# EAGLE design BLE (EAGLE 9.5.2)
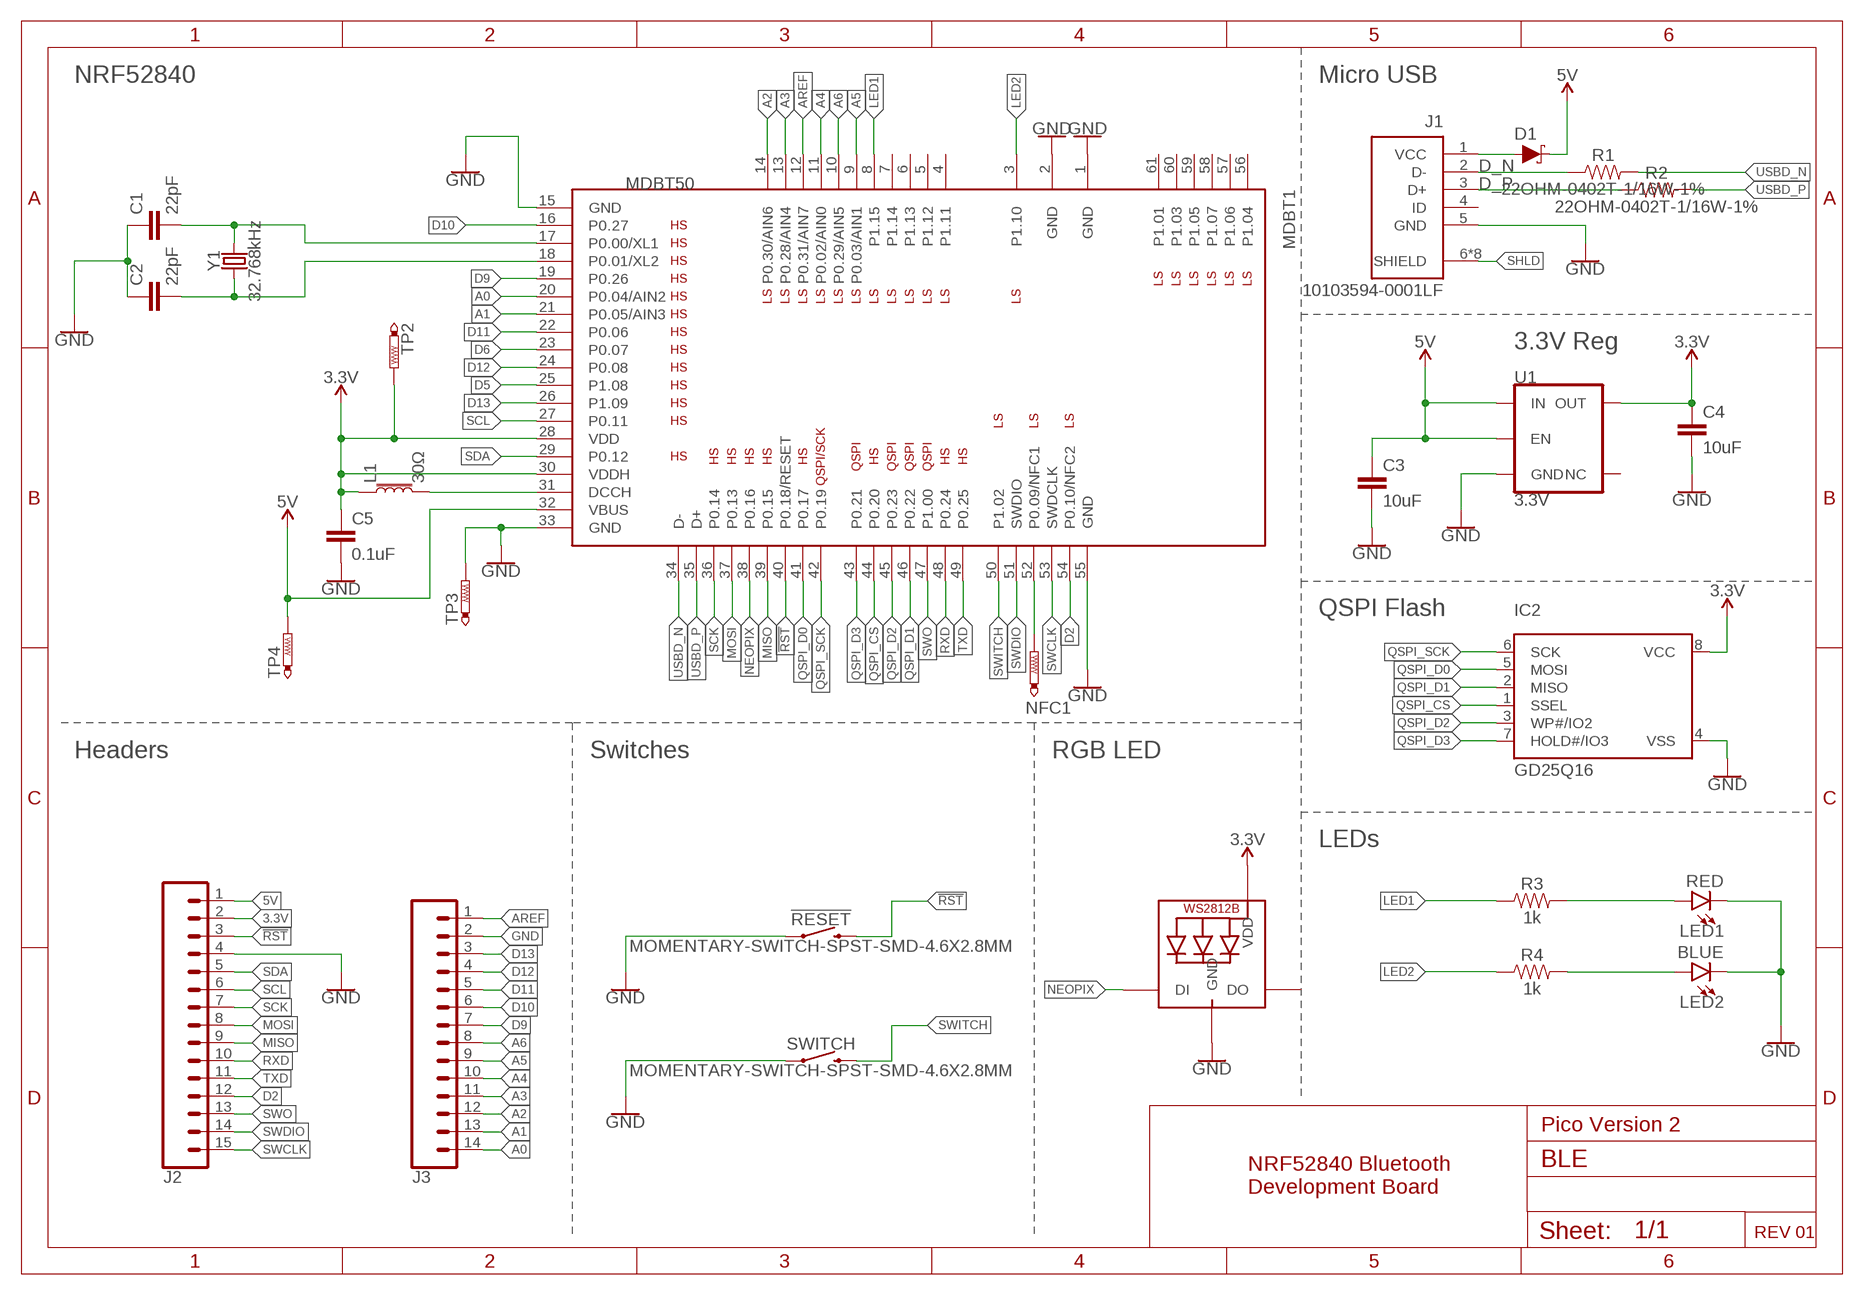
[diagram p0: schematic, sheet 1]

## Parts
!RESET!  MOMENTARY-SWITCH-SPST-SMD-4.6X2.8MM  [TACTILE_SWITCH_SMD_4.6X2.8MM]
C1  22pF  22PF-0402T-16V-10%  [0402-TIGHT]
C2  22pF  22PF-0402T-16V-10%  [0402-TIGHT]
C3  10uF  10UF-0603-6.3V-20%  [0603]
C4  10uF  10UF-0603-6.3V-20%  [0603]
C5  0.1uF  0.1UF-0402T-10V-10%-X7R  [0402-TIGHT]
D1  0.5A/40V/420mV  DIODE-SCHOTTKY-PMEG4005EJ  [SOD-323]
IC2  GD25Q16  SPIFLASH_8PINUX  [USON8]
J1  10103594-0001LF  [AMPHENOL_10103594-0001LF]
J2  CONN_15  [1X15]
J3  CONN_14  [1X14]
L1  30Ω  FERRITE_BEAD-0402-30OHM-100MHZ  [0402-TIGHT]
LED1  RED  LED-RED0603  [LED-0603]
LED2  BLUE  LED-BLUE0603  [LED-0603]
MDBT1  MDBT50  [MDBT50]
NFC1  PTR1TP10R  [TP10R]
R1  22OHM-0402T-1/16W-1%  [0402-TIGHT]
R2  22OHM-0402T-1/16W-1%  [0402-TIGHT]
R3  1k  1KOHM-0402T-1/16W-1%  [0402-TIGHT]
R4  1k  1KOHM-0402T-1/16W-1%  [0402-TIGHT]
RGB_LED  WS2812B_SK6805_1515  [SK6805_1515]
SWITCH  MOMENTARY-SWITCH-SPST-SMD-4.6X2.8MM  [TACTILE_SWITCH_SMD_4.6X2.8MM]
TP2  PTR1TP07R  [TP07R]
TP3  PTR1TP07R  [TP07R]
TP4  PTR1TP07R  [TP07R]
U1  3.3V  V_REG_AP2112K-3.3V  [SOT23-5]
Y1  32.768kHz  CRYSTAL-32.768KHZSMD-3.2X1.5  [CRYSTAL-SMD-3.2X1.5MM]

## Nets
3.3V: C4.1 C5.1 IC2.8(VCC) J2.2 L1.1 MDBT1.28(VDD) MDBT1.30(VDDH) RGB_LED.2(VDD) TP2.TP U1.5(OUT)
5V: C3.1 D1.C J2.1 MDBT1.32(VBUS) TP4.TP U1.1(IN) U1.3(EN)
!RST!: !RESET!.3 !RESET!.4 J2.3 MDBT1.40(P0.18/RESET)
A0: J3.14 MDBT1.20(P0.04/AIN2)
A1: J3.13 MDBT1.21(P0.05/AIN3)
A2: J3.12 MDBT1.14(P0.30/AIN6)
A3: J3.11 MDBT1.13(P0.28/AIN4)
A4: J3.10 MDBT1.11(P0.02/AIN0)
A5: J3.9 MDBT1.9(P0.03/AIN1)
A6: J3.8 MDBT1.10(P0.29/AIN5)
AREF: J3.1 MDBT1.12(P0.31/AIN7)
D2: J2.12 MDBT1.54(P0.10/NFC2)
D5: MDBT1.25(P1.08)
D6: MDBT1.23(P0.07)
D9: J3.7 MDBT1.19(P0.26)
D10: J3.6 MDBT1.16(P0.27)
D11: J3.5 MDBT1.22(P0.06)
D12: J3.4 MDBT1.24(P0.08)
D13: J3.3 MDBT1.26(P1.09)
D_N: J1.2(D-) R1.1
D_P: J1.3(D+) R2.1
GND: !RESET!.1 !RESET!.2 C1.1 C2.1 C3.2 C4.2 C5.2 IC2.4(VSS) J1.5(GND) J2.4 J3.2 LED1.C LED2.C MDBT1.1(GND) MDBT1.2(GND) MDBT1.15(GND) MDBT1.33(GND) MDBT1.55(GND) RGB_LED.4(GND) SWITCH.1 SWITCH.2 TP3.TP U1.2(GND)
LED1: MDBT1.8(P1.15) R3.1
LED2: MDBT1.3(P1.10) R4.1
MISO: J2.9 MDBT1.39(P0.15)
MOSI: J2.8 MDBT1.37(P0.13)
N$1: C1.2 MDBT1.17(P0.00/XL1) Y1.P$2
N$2: C2.2 MDBT1.18(P0.01/XL2) Y1.P$1
N$3: D1.A J1.1(VCC)
N$4: MDBT1.52(P0.09/NFC1) NFC1.TP
N$5: L1.2 MDBT1.31(DCCH)
N$8: LED1.A R3.2
N$9: LED2.A R4.2
NEOPIX: MDBT1.38(P0.16) RGB_LED.1(DI)
QSPI_CS: IC2.1(SSEL) MDBT1.44(P0.20)
QSPI_D0: IC2.5(MOSI) MDBT1.41(P0.17)
QSPI_D1: IC2.2(MISO) MDBT1.46(P0.22)
QSPI_D2: IC2.3(WP#/IO2) MDBT1.45(P0.23)
QSPI_D3: IC2.7(HOLD#/IO3) MDBT1.43(P0.21)
QSPI_SCK: IC2.6(SCK) MDBT1.42(P0.19)
RXD: J2.10 MDBT1.48(P0.24)
SCK: J2.7 MDBT1.36(P0.14)
SCL: J2.6 MDBT1.27(P0.11)
SDA: J2.5 MDBT1.29(P0.12)
SHLD: J1.6(SHIELD) J1.7(SHIELD) J1.8(SHIELD) J1.9(SHIELD) J1.10(SHIELD) J1.11(SHIELD) J1.S1(SHIELD) J1.S2(SHIELD)
SWCLK: J2.15 MDBT1.53(SWDCLK)
SWDIO: J2.14 MDBT1.51(SWDIO)
SWITCH: MDBT1.50(P1.02) SWITCH.3 SWITCH.4
SWO: J2.13 MDBT1.47(P1.00)
TXD: J2.11 MDBT1.49(P0.25)
USBD_N: MDBT1.34(D-) R1.2
USBD_P: MDBT1.35(D+) R2.2
Unconnected: J1.4(ID) MDBT1.4(P1.11) MDBT1.5(P1.12) MDBT1.6(P1.13) MDBT1.7(P1.14) MDBT1.56(P1.04) MDBT1.57(P1.06) MDBT1.58(P1.07) MDBT1.59(P1.05) MDBT1.60(P1.03) MDBT1.61(P1.01) RGB_LED.3(DO) U1.4(NC)

## Notes on the sheet
- NRF52840 | Micro USB
- 3.3V Reg
- QSPI Flash
- Headers | Switches | RGB LED
- LEDs
- Pico Version 2
- NRF52840 Bluetooth
  Development Board
- REV 01

## Library data of the parts
!RESET! SWITCH = SparkFun-Switches:MOMENTARY-SWITCH-SPST: Momentary Switch (Pushbutton) - SPST Normally-open (NO) SPST momentary switches (buttons, pushbuttons). Variants PTH-12MM - 12mm square, through-hole Momentary Pushbutton Switch - 12mm Square <https://www.sparkfun.com/products/9190> (COM-09190) PTH-6.0MM, PTH-6.0MM-KIT - 6.0mm square, through-hole Mini Pushbutton Switch <https://www.sparkfun.com/products/97> (COM-00097) KIT package intended for soldering kit's - only one side of pads' copper is exposed. PTH-RIGHT-ANGLE-KIT - Right-angle, through-hole Right Angle Tactile Button <https://www.sparkfun.com/products/10791> - Used on SparkFun BigTime Watch Kit <https://www.sparkfun.com/products/11734> SMD-12MM - 12mm square, surface-mount Tactile Button - SMD (12mm) <https://www.sparkfun.com/products/12993> (COM-12993) Used on SparkFun PicoBoard <https://www.sparkfun.com/products/11888> SMD-4.5MM - 4.5mm Square Trackball Switch Used on SparkFun Blackberry Trackballer Breakout <https://www.sparkfun.com/products/13169> SMD-4.6MMX2.8MM - 4.60mm x 2.80mm, surface mount Used on SparkFun SAMD21 Mini Breakout <https://www.sparkfun.com/products/13664> SMD-5.2MM, SMD-5.2-REDUNDANT - 5.2mm square, surface-mount Mini Pushbutton Switch - SMD <https://www.sparkfun.com/products/8720> (COM-08720) Used on Arduino Pro Mini <https://www.sparkfun.com/products/11114> REDUNDANT package connects both switch circuits together SMD-6.0X3.5MM - 6.0 x 3.5mm, surface mount Momentary Reset Switch SMD <https://www.sparkfun.com/products/8229> (COM-08229) SMD-6.2MM-TALL - 6.2mm square, surface mount Tactile Button - SMD (6mm) <https://www.sparkfun.com/products/12992> Used on SparkFun Digital Sandbox <https://www.sparkfun.com/products/12651> SMD-RIGHT-ANGLE - Right-angle, surface mount Used on SparkFun Block for Intel® Edison - Arduino <https://www.sparkfun.com/products/13036>; PROD_ID: SWCH-13065
C1 C2 = SparkFun-Capacitors:22PF: 22pF ceramic capacitors A capacitor is a passive two-terminal electrical component used to store electrical energy temporarily in an electric field.; PROD_ID: CAP-14674
C3 C4 = SparkFun-Capacitors:10UF: 10.0µF ceramic capacitors A capacitor is a passive two-terminal electrical component used to store electrical energy temporarily in an electric field.; PROD_ID: CAP-11015
C5 = SparkFun-Capacitors:0.1UF: 0.1µF ceramic capacitors A capacitor is a passive two-terminal electrical component used to store electrical energy temporarily in an electric field.; PROD_ID: CAP-15083
D1 = SparkFun-DiscreteSemi:DIODE-SCHOTTKY: Schottky diode A Schottky diode is a semiconductor diode which has a low forward voltage drop and a very fast switching action.; PROD_ID: DIO-10955
IC2 = microbuilder:SPIFLASH_8PIN: SOIC8 SPI Flash Be careful with the size since SOIC8 flash comes in several 'widths' SOIC8 150 mil M25P16 - 16Mbit (2Mbit x 8) Serial Flash (75MHz SPI Bus), Supply: 2.7-3.6V Digikey: SOIC8 - M25P16-VMN6P-ND SOIC8 208 mil W25Q16BVSSIG - 16Mbit (2Mbit x 8) Serial Flash (104MHz SPI Bus), Supply: 2.7-3.6V Digikey: SOIC8 - W25Q16BVSSIG-ND
J1 = 10103594-0001LF:10103594-0001LF: USB - micro B USB 2.0 Receptacle Connector 5 Position Surface Mount, Right Angle; Through Hole Check prices <https://pricing.snapeda.com/parts/10103594-0001LF/Amphenol%20ICC%20%28FCI%29/view-part?ref=eda>; AVAILABILITY: Good; DESCRIPTION: USB - micro B USB 2.0 Receptacle Connector 5 Position Surface Mount, Right Angle; Through Hole; MF: Amphenol ICC (FCI); MP: 10103594-0001LF; PACKAGE: None; PRICE: None; PURCHASE-URL: https://pricing.snapeda.com/search/part/10103594-0001LF/?ref=eda
J2 = SparkFun-Connectors:CONN_15: Multi connection point. Often used as Generic Header-pin footprint for 0.1 inch spaced/style header connections On any of the 0.1 inch spaced packages, you can populate with these: Break Away Headers - Straight <https://www.sparkfun.com/products/116> (PRT-00116) Break Away Male Headers - Right Angle <https://www.sparkfun.com/products/553> (PRT-00553) Female Headers <https://www.sparkfun.com/products/115> (PRT-00115) Break Away Headers - Machine Pin <https://www.sparkfun.com/products/117> (PRT-00117) Break Away Female Headers - Swiss Machine Pin <https://www.sparkfun.com/products/743> (PRT-00743) For SCREWTERMINALS and SPRING TERMINALS visit here: Screw Terimnals on SparkFun.com <https://www.sparkfun.com/search/results?term=Screw+Terminals> (5mm/3.5mm/2.54mm spacing) This device is also useful as a general connection point to wire up your design to another part of your project. Our various solder wires solder well into these plated through hole pads. Hook-Up Wire - Assortment (Stranded, 22 AWG) <https://www.sparkfun.com/products/11375> (PRT-11375) Hook-Up Wire - Assortment (Solid Core, 22 AWG) <https://www.sparkfun.com/products/11367> (PRT-11367) View the entire wire category on our website here <https://www.sparkfun.com/categories/141> Special notes: Molex polarized connector foot print use with SKU : PRT-08231 with associated crimp pins and housings. 1MM SMD Version SKU: PRT-10208 NOTES ON THE VARIANTS LOCK and LOCK_LONGPADS... This footprint was designed to help hold the alignment of a through-hole component (i.e. 6-pin header) while soldering it into place. You may notice that each hole has been shifted either up or down by 0.005 of an inch from it's more standard position (which is a perfectly straight line). This slight alteration caused the pins (the squares in the middle) to touch the edges of the holes. Because they are alternating, it causes a "brace" to hold the component in place. 0.005 has proven to be the perfect amount of "off-center" position when using our standard breakaway headers. Although looks a little odd when you look at the bare footprint, once you have a header in there, the alteration is very hard to notice. Also,if you push a header all the way into place, it is covered up entirely on the bottom side.
J3 = SparkFun-Connectors:CONN_14: Multi connection point. Often used as Generic Header-pin footprint for 0.1 inch spaced/style header connections On any of the 0.1 inch spaced packages, you can populate with these: Break Away Headers - Straight <https://www.sparkfun.com/products/116> (PRT-00116) Break Away Male Headers - Right Angle <https://www.sparkfun.com/products/553> (PRT-00553) Female Headers <https://www.sparkfun.com/products/115> (PRT-00115) Break Away Headers - Machine Pin <https://www.sparkfun.com/products/117> (PRT-00117) Break Away Female Headers - Swiss Machine Pin <https://www.sparkfun.com/products/743> (PRT-00743) For SCREWTERMINALS and SPRING TERMINALS visit here: Screw Terimnals on SparkFun.com <https://www.sparkfun.com/search/results?term=Screw+Terminals> (5mm/3.5mm/2.54mm spacing) This device is also useful as a general connection point to wire up your design to another part of your project. Our various solder wires solder well into these plated through hole pads. Hook-Up Wire - Assortment (Stranded, 22 AWG) <https://www.sparkfun.com/products/11375> (PRT-11375) Hook-Up Wire - Assortment (Solid Core, 22 AWG) <https://www.sparkfun.com/products/11367> (PRT-11367) View the entire wire category on our website here <https://www.sparkfun.com/categories/141> Special notes: Molex polarized connector foot print use with SKU : PRT-08231 with associated crimp pins and housings. 1MM SMD Version SKU: PRT-10208 NOTES ON THE VARIANTS LOCK and LOCK_LONGPADS... This footprint was designed to help hold the alignment of a through-hole component (i.e. 6-pin header) while soldering it into place. You may notice that each hole has been shifted either up or down by 0.005 of an inch from it's more standard position (which is a perfectly straight line). This slight alteration caused the pins (the squares in the middle) to touch the edges of the holes. Because they are alternating, it causes a "brace" to hold the component in place. 0.005 has proven to be the perfect amount of "off-center" position when using our standard breakaway headers. Although looks a little odd when you look at the bare footprint, once you have a header in there, the alteration is very hard to notice. Also,if you push a header all the way into place, it is covered up entirely on the bottom side.
L1 = SparkFun-Coils:FERRITE_BEAD: Ferrite Bead (blocks, cores, rings, chokes, etc.) Inductor with layers of ferrite used to suppress high frequencies. Often used to isolate high frequency noise. SparkFun Products: IOIO-OTG - V2.2 <https://www.sparkfun.com/products/13613> SparkFun SAMD21 Mini Breakout <https://www.sparkfun.com/products/13664> SparkFun 6 Degrees of Freedom Breakout - LSM6DS3 <https://www.sparkfun.com/products/13339> SparkFun SAMD21 Dev Breakout <https://www.sparkfun.com/products/13672>; PROD_ID: NDUC-15133
LED1 = SparkFun-LED:LED-RED: Red SMD LED Used in manufacturing of most products at SparkFun Packages: 0603 - SMD 0603 package [Product Link] <http://docs.avagotech.com/docs/AV02-0551EN> 0603 SMART - SMD 0603 SMART package ( more efficient and expensive)[Product Link] <http://www.osram-os.com/Graphics/XPic2/00077099_0.pdf> 1206 - SMD1206 package [Product Link] <https://www.sparkfun.com/datasheets/DevTools/LilyPad/Q150OVS4.pdff> SparkFun Products: Pro Mini 328 -5V <https://www.sparkfun.com/products/821> RedBoard <https://www.sparkfun.com/products/12757> IOIO-OTG <https://www.sparkfun.com/products/13613>; PROD_ID: DIO-00819
LED2 = SparkFun-LED:LED-BLUE: Blue SMD LED Used in manufacturing of various products at SparkFun Packages: 0603 - SMD 0603 package [Product Link] <http://www.digikey.com/product-detail/en/SMLE12BC7TT86/511-1589-2-ND/1641808> 1206 - SMD1206 package [Product Link] <http://www.digikey.com/product-detail/en/lite-on-inc/LTST-C150TBKT/160-1643-1-ND/573584> SparkFun Products: ESP8266 Thing-Dev Board <https://www.sparkfun.com/products/13711> RedBoard <https://www.sparkfun.com/products/12757>; PROD_ID: DIO-08575
MDBT1 = microbuilder:MDBT50: Raytac Corporation MDBT50 Bluetooth Low Energy Module based on Noridc nRF52840 Source: Raytac datasheet
NFC1 TP2-TP4 = testpad:PTR1: TEST PIN
R1 R2 = SparkFun-Resistors:22OHM: 22Ω resistor A resistor is a passive two-terminal electrical component that implements electrical resistance as a circuit element. Resistors act to reduce current flow, and, at the same time, act to lower voltage levels within circuits. - Wikipedia; PROD_ID: RES-14340
R3 R4 = SparkFun-Resistors:1KOHM: 1kΩ resistor A resistor is a passive two-terminal electrical component that implements electrical resistance as a circuit element. Resistors act to reduce current flow, and, at the same time, act to lower voltage levels within circuits. - Wikipedia; PROD_ID: RES-14342
RGB_LED = microbuilder:WS2812B
U1 = SparkFun-IC-Power:V_REG_AP2112: AP2112 - 600mA CMOS LDO Regulator w/ Enable The AP2112 is CMOS process low dropout linear regulator with enable function, the regulator delivers a guaranteed 600mA (min.) continuous load current. Features Output Voltage Accuracy: ±1.5% Output Current: 600mA (Min.) Foldback Short Current Protection: 50mA Enable Function to Turn ON/OFF VOUT Low Dropout Voltage (3.3V): 250mV (Typ.) @IOUT=600mA Excellent Load Regulation: 0.2%/A (Typ.) Excellent Line Regulation: 0.02%/V (Typ.) Low Quiescent Current: 55μA (Typ.) Low Standby Current: 0.01μA (Typ.) Low Output Noise: 50μVRMS PSRR: 100Hz -65dB, 1kHz -65dB OTSD Protection Stable with 1.0μF Flexible Cap: Ceramic, Tantalum and Aluminum Electrolytic Operation Temperature Range: -40°C to 85°C ESD: MM 400V, HBM 4000V; PROD_ID: VREG-12457
Y1 = SparkFun-Clocks:CRYSTAL-32.768KHZ: 32.768kHz Crystal Frequency: 32.768kHz Frequency Stability: ±20ppm Load Capacitance: 12.5pF (PTH-2X6 & SMD-3.2X1.5), 6pF (SMD-2X6) SparkFun Products: SparkFun BigTime Watch Kit <https://www.sparkfun.com/products/11734> SparkFun nRF52832 Breakout <https://www.sparkfun.com/products/13990> SparkFun Real Time Clock Module <https://www.sparkfun.com/products/12708>; PROD_ID: XTAL-13062

## Board
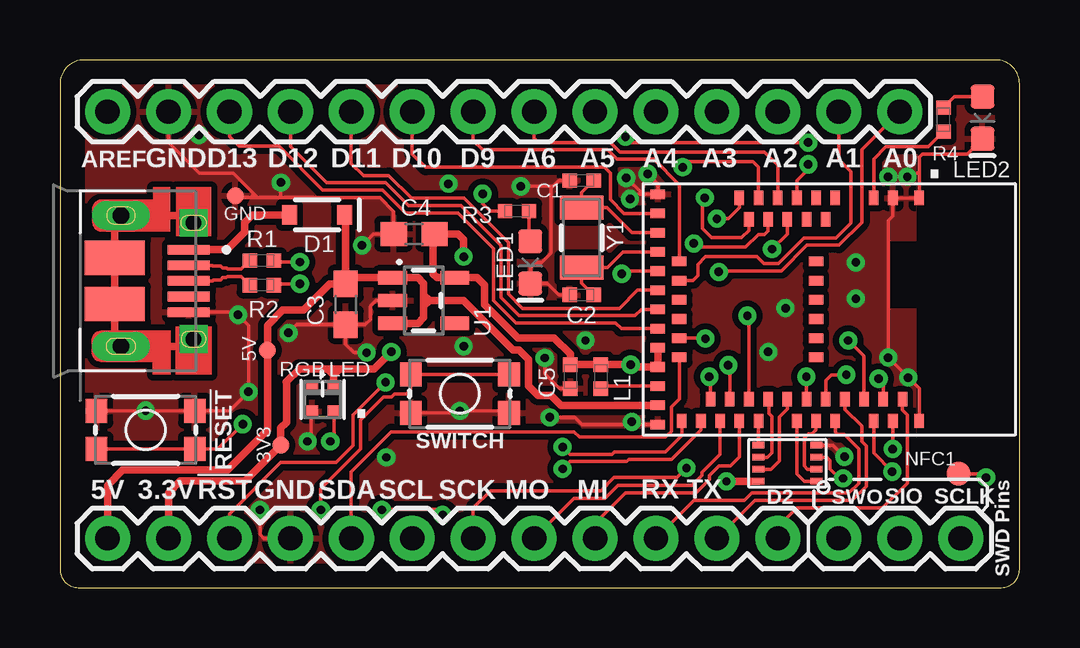
[diagram p1: board, top side]
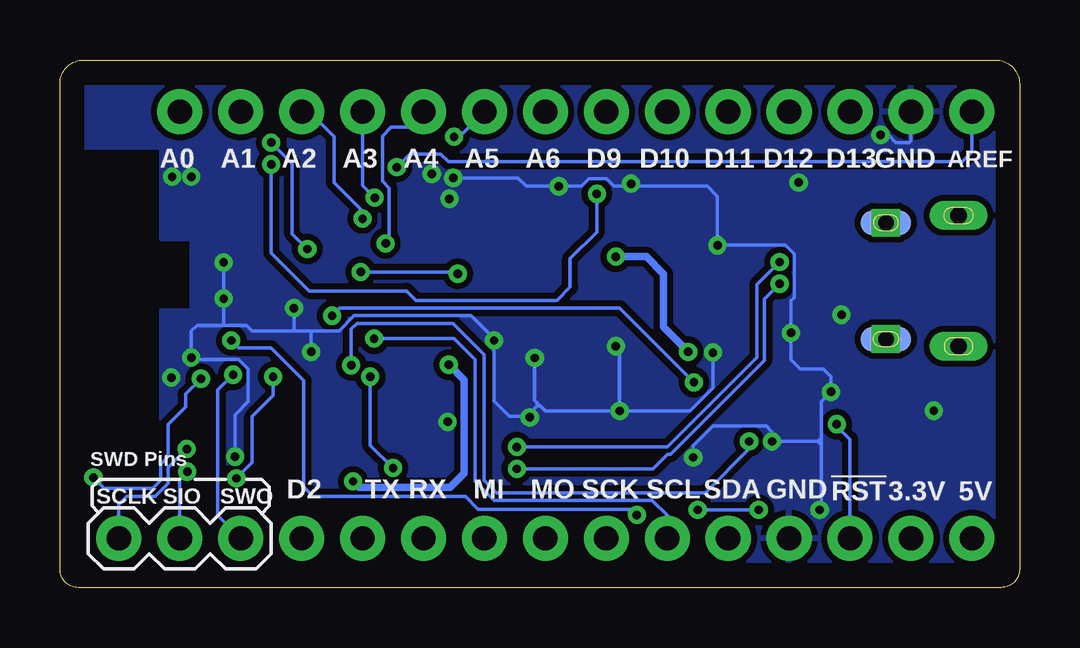
[diagram p2: board, bottom side, seen from below]

Size 40 x 22 mm. Coordinates in mm from the lower left corner, seen from the top.
Outline: 39.01,22 1,22 arc90 0,21 0,0.76 arc90 0.76,0 39.25,0 arc90 40,0.75 40,21.01 arc90 39.01,22
Copper layers (1*16): Top 0.035mm / dielectric 1.5mm / Bottom 0.035mm
Design rules "default *": minimum track width 6mil, minimum drill 0.35mm, track to track 6mil, track to pad 6mil, pad to pad 6mil, via to via 6mil, smd to smd 6mil, copper to edge 40mil, drill to drill 6mil, minimum pad ring 10mil, minimum via ring 8mil, stop-mask expansion 4mil, vias tented up to drill 15mil, thermal gap 10mil

### Footprints (pad centres in the part's own frame; a part is rotated, then mirrored left to right if it is on the bottom)
TACTILE_SWITCH_SMD_4.6X2.8MM = smd 0.9 x 1: 1 -2.05,-0.8; 2 2.05,-0.8; 3 2.05,0.8; 4 -2.05,0.8
0402-TIGHT = smd 0.6 x 0.6: 1 -0.5,0; 2 0.5,0
0603 = smd 1.1 x 1: 1 -0.85,0; 2 0.85,0
SOD-323 = smd 0.63 x 0.83: A 1.15,0; C -1.15,0
USON8 = smd 0.5 x 0.275: 1 -1.2,0.75; 2 -1.2,0.25; 3 -1.2,-0.25; 4 -1.2,-0.75; 5 1.2,-0.75; 6 1.2,-0.25; 7 1.2,0.25; 8 1.2,0.75
AMPHENOL_10103594-0001LF = smd 0.4 x 1.75: 1 -1.3,2.825; 2 -0.65,2.825; 3 0,2.825; 4 0.65,2.825; 5 1.3,2.825 | drill 0.65 pad 0.73 square: 6 -2.425,3.03; 7 2.425,3.03 | drill 0.7 pad 1.2 long: 8 -2.725,0; 9 2.725,0 | smd 1.05 x 2.1 bottom: 10 -2.425,3.03; 11 2.425,3.03 | smd 1.425 x 2.5: S1 -0.963,-0.25; S2 0.963,-0.25
1X15 = drill 1.016 pad 1.88: 1 0,0; 2 2.54,0; 3 5.08,0; 4 7.62,0; 5 10.16,0; 6 12.7,0; 7 15.24,0; 8 17.78,0; 9 20.32,0; 10 22.86,0; 11 25.4,0; 12 27.94,0; 13 30.48,0; 14 33.02,0; 15 35.56,0
1X14 = drill 1.016 pad 1.88: 1 0,0; 2 2.54,0; 3 5.08,0; 4 7.62,0; 5 10.16,0; 6 12.7,0; 7 15.24,0; 8 17.78,0; 9 20.32,0; 10 22.86,0; 11 25.4,0; 12 27.94,0; 13 30.48,0; 14 33.02,0
LED-0603 = smd 1 x 1: A -0.877,0; C 0.877,0
MDBT50 = smd 0.6 x 0.4: 1 -4.65,3.75; 2 -4.65,2.65; 3 -4.65,1.85; 4 -4.65,0.25; 5 -3.75,-0.15; 6 -4.65,-0.55; 7 -3.75,-0.95; 8 -4.65,-1.35; 9 -3.75,-1.75; 10 -4.65,-2.15; 11 -3.75,-2.55; 12 -4.65,-2.95; 13 -3.75,-3.35; 14 -4.65,-3.75; 34 4.65,-6.15; 35 4.65,-5.35; 36 3.75,-4.95; 37 4.65,-4.55; 38 3.75,-4.15; 39 4.65,-3.75; 40 3.75,-3.35; 41 4.65,-2.95; 42 3.75,-2.55; 43 3.75,-1.75; 44 4.65,-1.35; 45 3.75,-0.95; 46 4.65,-0.55; 47 3.75,-0.15; 48 4.65,0.25; 49 3.75,0.65; 50 3.75,1.45; 51 4.65,1.85; 52 3.75,2.25; 53 4.65,2.65; 54 3.75,3.05; 55 4.65,3.75 | smd 0.4 x 0.6: 15 -4.8,-7.15; 16 -4,-7.15; 17 -3.2,-7.15; 18 -2.4,-7.15; 19 -2,-6.25; 20 -1.6,-7.15; 21 -1.2,-6.25; 22 -0.8,-7.15; 23 -0.4,-6.25; 24 0,-7.15; 25 0.4,-6.25; 26 0.8,-7.15; 27 1.2,-6.25; 28 1.6,-7.15; 29 2,-6.25; 30 2.4,-7.15; 31 3.2,-7.15; 32 4,-7.15; 33 4.8,-7.15; 56 -2,-0.55; 57 -1.2,-0.55; 58 -0.4,-0.55; 59 0.4,-0.55; 60 1.2,-0.55; 61 2,-0.55
TP10R = smd 1 x 1: TP 0,0
SK6805_1515 = smd 0.5 x 0.5: 1 -0.5,-0.45; 2 0.5,-0.45; 3 0.5,0.45; 4 -0.5,0.45
TP07R = smd 0.7 x 0.7: TP 0,0
SOT23-5 = smd 0.55 x 1.2: 1 -0.95,-1.3; 2 0,-1.3; 3 0.95,-1.3; 4 0.95,1.3; 5 -0.95,1.3
CRYSTAL-SMD-3.2X1.5MM = smd 1 x 1.8: P$1 -1.25,0; P$2 1.25,0

### Placement (x,y rotation side)
!RESET!  3.57,6.57 180 top
C1  21.75,16.97 0 top
C2  21.75,12.21 0 top
C3  11.91,11.81 270 top
C4  14.76,14.75 180 top
C5  21.27,8.79 270 top
D1  10.72,15.54 180 top
IC2  30.32,5.18 180 top
J1  2.54,12.79 270 top
J2  1.99,2.05 0 top
J3  1.98,19.84 0 top
L1  22.54,8.79 270 top
LED1  19.61,13.56 270 top
LED2  38.46,19.59 270 top
MDBT1  32.07,11.6 270 top
NFC1  37.47,4.75 0 top
R1  8.41,13.64 0 top
R2  8.41,12.6 0 top
R3  19.05,15.7 0 top
R4  36.83,19.51 90 top
RGB_LED  10.95,7.84 90 top
SWITCH  16.67,8.08 0 top
TP2  9.21,5.94 0 top
TP3  7.3,16.34 0 top
TP4  8.65,9.91 0 top
U1  15.16,11.97 270 top
Y1  21.75,14.59 90 top

### Tracks (layer width: path | path; a pad name or v marks a point on that pad's centre or on a via)
3.3V  (via drill 0.35)
  Top 0.305: J2.2 4.53,3.95 5.02,4.45 7.72,4.45 TP2.TP 9.21,6.65 9.45,6.89 9.45,8.56 9.44,8.57 9.98,9.11 11.17,9.11 | 11.17,9.11 11.43,9.11 | MDBT1.28 MDBT1.30 23.89,9.2 v23.79,9.29 L1.1 C5.1 21.27,9.75 20.6,10.41 19.1,10.41 17.7,11.81 17.7,12.6 17.39,12.92 U1.5 15.72,12.92 15.56,13.08 15.56,14.69 C4.1 16.59,14.75 16.83,14.51 v16.83,13.79 | RGB_LED.2 11.4,8.87 | 11.4,8.87 11.4,9.06 11.43,9.09 11.43,9.11 | v27.78,4.43 IC2.8 | v13.81,9.83 13.1,9.11 11.59,9.11 | 11.43,9.11 11.59,9.11 | 11.4,8.87 11.17,9.11 | 11.4,8.87 11.59,9.06 11.59,9.11
  Bottom 0.305: v23.79,9.29 23.15,8.66 23.15,4.77 23.74,4.18 27.54,4.18 v27.78,4.43 | v13.81,9.83 14.84,10.86 14.84,13.08 15.56,13.79 v16.83,13.79
5V
  Top 0.305: C3.1 11.91,15.5 D1.C | C3.1 12.16,12.92 U1.1 14.93,12.92 15.16,12.68 15.16,12.21 | C3.1 11.25,12.66 10.16,11.57 9.29,11.57 8.65,10.94 TP4.TP 8.65,6.57 6.99,4.91 2.62,4.91 1.98,4.27 J2.1 | U1.3 14.93,11.02 15.16,11.26 15.16,11.73 | 15.16,11.73 15.16,11.97 | 15.16,11.97 15.16,12.21 | MDBT1.32 22.46,7.6 20.88,7.6 20.48,8 19.92,8 19.53,8.4 19.53,9.51 19.13,9.91 18.89,9.91 16.83,11.97 15.4,11.97 | 15.16,11.97 15.4,11.97 | 15.4,11.97 15.16,12.21 | 15.4,11.97 15.16,11.73
!RST!  (via drill 0.35)
  Top 0.152: J2.3 7.07,3.08 9.21,5.22 11.51,5.22 12.22,5.94 12.22,7.21 v13.57,8.56 | MDBT1.40 28.72,11.27 v28.65,11.33 | v7.62,6.81 6.58,5.77 !RESET!.4 !RESET!.3
  Bottom 0.152: v28.65,11.33 28.34,11.65 16.67,11.65 v13.57,8.56 | v7.62,6.81 7.62,6.73 7.07,6.18 J2.3
A0  (via drill 0.35)
  Top 0.152: J3.14 33.42,18.26 33.42,15.22 32.46,14.27 31.13,14.27 30.06,13.2 27.5,13.2 v27.46,13.16 | MDBT1.20 23.53,13.2 v23.42,13.08
  Bottom 0.152: v23.42,13.08 23.5,13.16 v27.46,13.16
A1
  Top 0.152: MDBT1.21 26.39,12.8 26.59,13 26.59,13.48 26.91,13.79 29.05,13.79 29.34,13.51 29.94,13.51 31.01,14.58 32.34,14.58 32.96,15.2 32.96,17.34 32.46,17.84 J3.13
A2  (via drill 0.35)
  Top 0.152: MDBT1.14 28.32,15.84 27.86,15.38 v27.38,15.38
  Bottom 0.152: v27.38,15.38 27.38,15.7 28.57,16.89 28.57,18.8 29.62,19.84 J3.12
A3  (via drill 0.35)
  Top 0.152: MDBT1.13 28.72,14.89 28.42,14.59 27.16,14.59 26.78,14.97 26.78,16.15 v26.88,16.26
  Bottom 0.152: v26.88,16.26 27.38,16.76 J3.11
A4  (via drill 0.35)
  Top 0.152: MDBT1.11 29.52,14.87 29.37,14.72 29.11,14.72 28.57,14.19 26.58,14.19 v26.42,14.35
  Bottom 0.152: J3.10 24.84,19.75 25.4,19.19 26.19,19.19 26.56,18.82 26.56,16.94 26.27,16.65 26.27,14.5 v26.42,14.35
A5  (via drill 0.35)
  Top 0.152: v23.57,18.8 23.81,18.56 v31.19,18.56 | MDBT1.9 30.32,14.74 v29.69,14.11
  Bottom 0.152: J3.9 23.35,18.8 v23.57,18.8 | v29.69,14.11 30.32,14.75 30.32,17.68 v31.19,18.56
A6
  Top 0.152: MDBT1.10 29.92,17.61 29.37,18.16 23.35,18.16 22.95,18.56 19.94,18.56 19.76,18.73 J3.8
AREF  (via drill 0.35)
  Top 0.152: MDBT1.12 29.12,17.54 28.89,17.77 26.19,17.77 v25.96,17.53
  Bottom 0.152: J3.1 1.98,18.16 2.38,17.76 23.81,17.76 24.13,18.08 25.4,18.08 v25.96,17.53
D2
  Top 0.152: MDBT1.54 35.12,7.41 35.32,7.21 35.32,4.35 34.29,3.32 30.72,3.32 29.93,2.52 J2.12
D9
  Top 0.152: MDBT1.19 25.82,16.79 24.75,17.86 23.23,17.86 22.83,18.25 17.61,18.25 17.22,18.64 J3.7
D10
  Top 0.152: MDBT1.16 23.52,15.6 22.94,16.18 22.94,17.29 22.7,17.53 15.24,17.53 14.68,18.08 J3.6
D11
  Top 0.152: MDBT1.22 24.08,12.4 23.33,11.64 19.29,11.64 18.69,12.24 18.69,14.38 16.84,16.23 14.65,16.23 13.7,17.18 12.65,17.18 12.14,17.68 J3.5
D12
  Top 0.152: J3.4 9.6,18.39 11.11,16.88 13.57,16.88 14.53,15.93 16.72,15.93 18.39,14.26 18.39,12.1 19.14,11.34 23.98,11.34 24.23,11.6 MDBT1.24
D13
  Top 0.152: MDBT1.26 23.4,10.8 23.16,11.03 19.02,11.03 18.08,11.97 18.08,14.13 16.59,15.62 14.4,15.62 13.45,16.57 10.95,16.57 9.13,18.4 7.46,18.4 7.06,18.8 J3.3
D_N
  Top 0.152: R1.1 7.55,13.27 6.99,13.27 6.94,13.32 6.78,13.32 6.7,13.4 6.39,13.4 6.36,13.44 J1.2
D_P
  Top 0.152: R2.1 7.55,12.97 6.99,12.97 6.94,12.92 6.78,12.92 6.69,12.82 6.39,12.82 6.36,12.79 J1.3
GND  (via drill 0.35)
  Top 0.152: C3.2 12.72,10.96 12.94,11.18 12.94,11.73 13.18,11.97 U1.2 | 35.82,17.37 MDBT1.1 MDBT1.2 34.72,15.49 34.53,15.3 v34.53,9.59 v35.36,8.75 35.82,8.3 MDBT1.55 | 35.82,17.37 35.82,17.94 35.96,18.08 37.83,18.08 LED2.C | C2.1 20.8,12.21 20.32,12.68 LED1.C 19.61,13.32 19.84,13.56 20.08,13.56 20.48,13.95 20.48,16.65 | IC2.4 32.23,5.93 v32.7,5.46 | J2.4 8.49,2.05 8.33,2.21 v8.33,3.24 | v10.32,6.1 10.48,6.25 10.48,7.32 RGB_LED.4 | J1.5 7.3,11.49 v7.42,11.37 7.86,10.94 v7.86,8.16 7.07,7.37 !RESET!.1 5.59,7.34 5.55,7.37 v3.57,7.37 !RESET!.2 | C3.2 9.87,10.96 v9.53,10.62 | C5.2 20.82,8.29 20.21,8.91 v20.21,9.57 | v12.78,9.79 12.26,9.79 11.91,10.14 C3.2 | C1.1 20.79,16.97 20.56,16.73 | 20.56,16.73 20.48,16.65 | J3.2 4.52,18.56 5.79,17.29 7.22,17.29 8.06,16.45 | 8.06,16.45 8.24,16.27 | 8.24,16.27 9.21,16.27 | 9.21,16.27 12.85,16.27 12.86,16.26 13.34,16.26 13.91,15.68 C4.2 13.07,14.75 v12.59,14.27 | 23.81,6.8 21.76,6.8 21.46,7.1 v20.41,7.1 | 23.81,6.8 MDBT1.33 | SWITCH.2 18.63,7.37 v16.67,7.37 16.58,7.28 SWITCH.1 | v24.5,17.25 24.92,16.83 MDBT1.15 24.31,16.4 | 35.82,17.37 35.58,17.13 v35.32,17.13 v34.53,17.13 | 23.81,6.8 23.84,6.82 v23.84,6.91 | 8.24,16.27 7.94,16.27 | 7.94,16.27 7.37,16.27 TP3.TP | 8.06,16.45 8.06,16.39 7.94,16.27 | v23.61,17.08 23.62,17.08 24.31,16.4 | 24.31,16.4 23.95,16.4 v23.77,16.21 | 20.48,16.65 20.4,16.73 | 20.4,16.73 v19.21,16.73 | 20.4,16.73 20.56,16.73 | 9.21,16.27 v9.21,16.89
  Bottom 0.152: v32.7,5.46 32.7,7.21 32.15,7.76 32.15,9.11 32.54,9.51 34.45,9.51 v34.53,9.59 34.53,10.7 34.29,10.94 33.18,10.94 | v23.61,17.08 20.91,17.08 20.56,16.73 v19.21,16.73 18.26,16.73 17.94,17.05 17.22,17.05 16.91,16.73 16.35,16.73 | 30.24,10.7 31.99,10.7 32.23,10.94 33.18,10.94 | 30.24,10.7 29.53,10.7 | 29.53,10.7 28.37,10.7 27.74,11.33 22.86,11.33 21.91,10.38 v21.91,10.3 21.91,7.78 21.26,7.13 20.41,7.13 | v12.78,9.79 12.78,8.32 13.73,7.37 v16.67,7.37 | 8.41,6.1 v10.32,6.1 10.32,6.49 10.56,6.73 12.78,6.73 13.61,5.9 v13.61,5.43 | 8.41,6.1 8.26,6.1 | 8.26,6.25 8.26,7.76 v7.86,8.16 7.86,8.79 8.18,9.11 9.13,9.11 9.53,9.51 v9.53,10.62 9.53,11.97 9.39,12.1 9.39,13.9 9.76,14.27 v12.59,14.27 12.59,16.3 13.02,16.73 16.03,16.73 16.09,16.73 | 8.26,6.25 8.26,6.1 | v8.33,3.24 8.26,3.32 8.26,5.94 | 8.26,5.94 8.26,6.1 | 8.26,5.94 8.41,6.1 | 8.41,6.1 8.26,6.25 | v16.67,7.37 19.76,7.37 19.96,7.56 | v20.21,9.57 20.21,7.81 20.12,7.72 | 20.12,7.72 20.04,7.64 | 20.04,7.64 19.96,7.56 | 20.04,7.64 20.12,7.56 | 20.12,7.56 20.12,7.72 | 19.96,7.56 20.12,7.56 | 20.12,7.56 20.41,7.27 20.41,7.13 | 20.41,7.13 v20.41,7.1 | 30.24,10.7 v30.24,11.65 | v33.18,13.56 v33.18,12.05 33.18,10.94 | 29.53,10.7 v29.53,9.83 | v5.79,18.88 5.48,18.88 5.16,18.56 4.6,18.56 4.52,18.64 J3.2 | v16.67,7.37 16.67,9.91 v16.83,10.06 | 16.35,16.73 16.09,16.73 | 16.35,16.73 16.25,16.84 v16.19,16.84 16.09,16.73
  pour Top (isolate 0.254): 0,21.97 0,-0.02 40.01,-0.02 40.01,4.83 35.8,4.83 35.8,11.57 34.53,11.57 34.53,14.51 35.8,14.51 35.8,18.32 40.01,18.32 40.01,21.97
  pour Bottom (isolate 0.254): 0,21.97 0,-0.02 40.01,-0.02 40.01,4.83 35.8,4.83 35.8,11.57 34.53,11.57 34.53,14.51 35.8,14.51 35.8,18.32 40.01,18.32 40.01,21.97
LED1  (via drill 0.35)
  Top 0.152: MDBT1.8 30.72,16.97 31.19,17.45 v31.19,17.65 | v17.62,16.41 17.62,16.02 17.94,15.7 R3.1
  Bottom 0.152: v31.19,17.65 31.19,13.95 29.61,12.37 25.56,12.37 25.16,11.97 19.29,11.97 18.73,12.53 18.73,13.72 17.62,14.83 v17.62,16.41
LED2
  Top 0.152: R4.1 36.21,18.39 34.44,18.39 33.92,17.87 MDBT1.3
MISO
  Top 0.152: MDBT1.39 28.32,5.44 27.94,5.06 27.46,5.06 27.07,4.67 27.07,4.51 26.51,3.95 23.57,3.95 22.3,2.68 J2.9
MOSI
  Top 0.152: MDBT1.37 27.52,5.55 26.76,4.79 26.76,4.67 26.35,4.26 23.26,4.26 22.71,3.71 21.43,3.71 J2.8
N$1
  Top 0.152: C1.2 21.75,16.47 Y1.P$2 22.8,15.84 23.84,14.8 MDBT1.17
N$2
  Top 0.152: MDBT1.18 23.47,14 22.82,13.34 Y1.P$1 21.75,12.71 C2.2
N$3
  Top 0.305: J1.1 6.96,14.09 7.7,14.83 7.7,15.22 8.02,15.54 D1.A
N$4  (via drill 0.35)
  Top 0.152: MDBT1.52 34.32,8.51 v34.12,8.71 | v38.61,4.59 38.45,4.75 NFC1.TP
  Bottom 0.152: v34.12,8.71 34.77,8.07 34.77,7.52 35.48,6.81 35.48,5.46 35.8,5.14 35.8,4.46 36.13,4.13 38.15,4.13 v38.61,4.59
N$5
  Top 0.152: MDBT1.31 22.64,8.4 L1.2
N$8
  Top 0.152: R3.2 19.55,14.49 LED1.A
N$9
  Top 0.152: R4.2 37.29,20.47 LED2.A
NEOPIX  (via drill 0.35)
  Top 0.152: MDBT1.38 27.92,9.21 v27.86,9.27 | v11.27,6.1 11.43,6.25 11.43,7.32 RGB_LED.1
  Bottom 0.152: v27.86,9.27 27.86,10.78 27.62,11.02 23.62,11.02 22.32,9.71 22.32,4.48 21.79,3.95 13.1,3.95 11.27,5.78 v11.27,6.1
QSPI_CS
  Top 0.152: IC2.1 31.03,4.43 30.72,4.75 MDBT1.44
QSPI_D0
  Top 0.152: IC2.5 MDBT1.41
QSPI_D1
  Top 0.152: IC2.2 31.15,4.93 31.02,5.06 31.02,6.24 31.19,6.41 31.35,6.41 31.52,6.58 MDBT1.46
QSPI_D2  (via drill 0.35)
  Top 0.152: MDBT1.45 v31.12,8.79 v31.11,8.79 | IC2.3 31.96,5.43 32.09,5.3 32.09,4.96 32.5,4.55 v32.65,4.55
  Bottom 0.152: v31.11,8.79 31.11,8 31.99,7.13 31.99,5.21 v32.65,4.55
QSPI_D3
  Top 0.152: IC2.7 29.64,4.93 29.99,5.29 29.99,7.12 30.32,7.44 MDBT1.43
QSPI_SCK
  Top 0.152: IC2.6 29.5,5.43 29.69,5.62 29.69,7.13 29.55,7.27 29.55,7.82 MDBT1.42
RXD
  Top 0.152: MDBT1.48 32.32,6.48 32.41,6.38 32.7,6.38 33.31,5.77 33.31,4.35 32.89,3.94 28.84,3.94 28.54,3.63 26.43,3.63 J2.10
SCK  (via drill 0.35)
  Top 0.152: J2.7 17.23,3.32 17.94,4.03 22.54,4.03 23.1,4.59 25.72,4.59 v26.11,4.98 | v27.07,8.79 27.12,8.74 MDBT1.36
  Bottom 0.152: v26.11,4.98 27.07,5.94 v27.07,8.79
SCL  (via drill 0.35)
  Top 0.152: MDBT1.27 26.89,10.4 v26.91,10.38
  Bottom 0.152: v26.91,10.38 23.57,10.38 22.7,9.51 22.7,4.43 21.91,3.63 15.32,3.63 14.69,3 J2.6
SDA
  Top 0.152: MDBT1.29 25.82,7.86 25.48,7.52 25.48,6.51 25.24,6.27 21.65,6.27 21.43,6.49 13.81,6.49 12.14,4.83 J2.5
SHLD
  Top 0.305: J1.11 5.27,10.06 J1.9 2.29,10.31 J1.S2 J1.S1 2.29,15.26 J1.8 5.27,15.51 J1.10
SWCLK  (via drill 0.35)
  Top 0.152: MDBT1.53 v34.72,5.78
  Bottom 0.152: J2.15 37.55,3.48 37.23,3.79 36.04,3.79 35.48,4.35 35.48,5.01 v34.72,5.78
SWDIO  (via drill 0.35)
  Top 0.152: MDBT1.51 33.92,5.61 v34.69,4.83
  Bottom 0.152: v34.69,4.83 35.01,4.52 J2.14
SWITCH  (via drill 0.35)
  Top 0.152: MDBT1.50 33.52,9.65 v32.86,10.3 | SWITCH.3 SWITCH.4 14.61,8.87 14.61,8.24 14.45,8.08 13.96,8.08 13.82,7.95 13.49,7.95 12.54,7 12.54,5.78 10.87,4.11 v10.87,3.24 | v13.41,3.24 13.44,3.27 15.72,3.27 v15.95,3.03
  Bottom 0.152: v32.86,10.3 32.54,9.98 31.19,9.98 29.84,8.64 29.84,4.19 29.45,3.79 23.1,3.79 22.57,3.27 16.19,3.27 v15.95,3.03 | v13.41,3.24 v10.87,3.24
SWO  (via drill 0.35)
  Top 0.152: MDBT1.47 31.92,8.64 32.15,8.87 v32.78,8.87
  Bottom 0.152: v32.78,8.87 33.42,8.24 33.42,7.92 33.42,3 J2.13
TXD
  Top 0.152: MDBT1.49 32.72,7.43 33.42,6.73 33.42,6.1 33.61,5.9 33.61,4.23 33.02,3.63 28.97,3.63 J2.11
USBD_N  (via drill 0.35)
  Top 0.152: R1.2 8.97,13.57 v10,13.57 | v20.95,5.86 21.26,5.55 23.02,5.55 23.11,5.65 25.23,5.65 25.92,6.34 MDBT1.34
  Bottom 0.152: v10,13.57 10.94,12.63 10.94,9.59 14.67,5.86 v20.95,5.86
USBD_P  (via drill 0.35)
  Top 0.152: R2.2 8.97,12.67 v10,12.67 | v20.95,4.95 21.26,5.25 23.62,5.25 23.71,5.35 25.49,5.35 26.72,6.57 MDBT1.35
  Bottom 0.152: v10,12.67 10.64,12.03 10.64,9.46 14.54,5.55 14.67,5.55 15.28,4.95 v20.95,4.95

### Text on the board
tNames: AREF | GND | D13 | D12 | D11 | D10 | D9 | A6 | A5 | A4 | A3 | A2 | A1 | A0 | . | GND | 5V | RGB | LED | 3V3 | . | 5V | 3.3V | !RST! | GND | SDA | SCL | SCK | MO | MI | SWD Pins | RX | TX | D2 | SWO | SIO | SCLK
bNames: AREF | GND | D13 | D12 | D11 | D10 | D9 | A6 | A5 | A4 | A3 | A2 | A1 | A0 | SWD Pins | 5V | 3.3V | !RST! | GND | SDA | SCL | SCK | MO | MI | RX | TX | D2 | SWO | SIO | SCLK